# Altium project PCB_Project1.PrjPCB
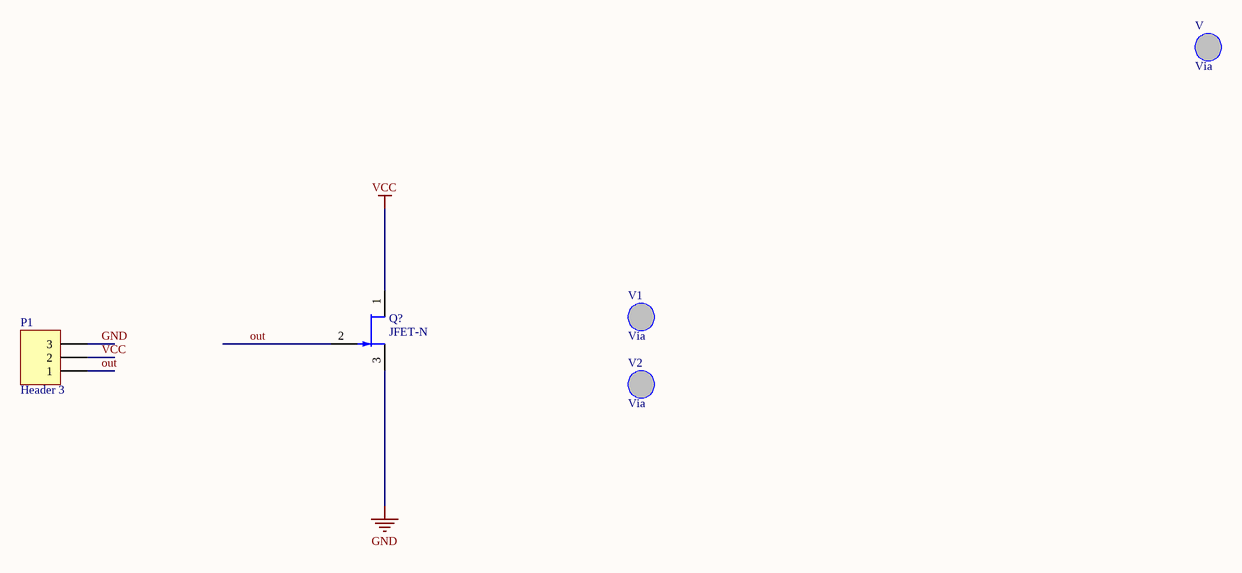
[diagram p0: Sheet1.SchDoc]
1 sheet, 5 parts. Net scope: global (net labels, ports and power ports of the same name join across sheets).
Board file: PCB1.PcbDoc

## Sheet Sheet1.SchDoc
size A4

### Parts
P1  Header 3  [sh-2.0]
Q?  JFET-N  [TO-254-AA]
V  Via  [Via]
V1  Via  [Via]
V2  Via  [Via]

### Nets
GND: P1.3 Q?.3(S)
VCC: P1.2 Q?.1(D)
out: P1.1 Q?.2(G)

### Library data of the parts
P1 = Header 3: Header, 3-Pin; LatestRevisionDate: 17-Jul-2002; LatestRevisionNote: Re-released for DXP Platform.; Publisher: Altium Limited
Q? = JFET-N: N-Channel JFET; Published: 8-Jun-2000; LatestRevisionDate: 17-Jul-2002; LatestRevisionNote: Re-released for DXP Platform.; PackageReference: TO-254-AA; Publisher: Altium Limited; Code_JEDEC: TO-254-AA